# Altium schematic sheet Smartcar.SchDoc
size A2
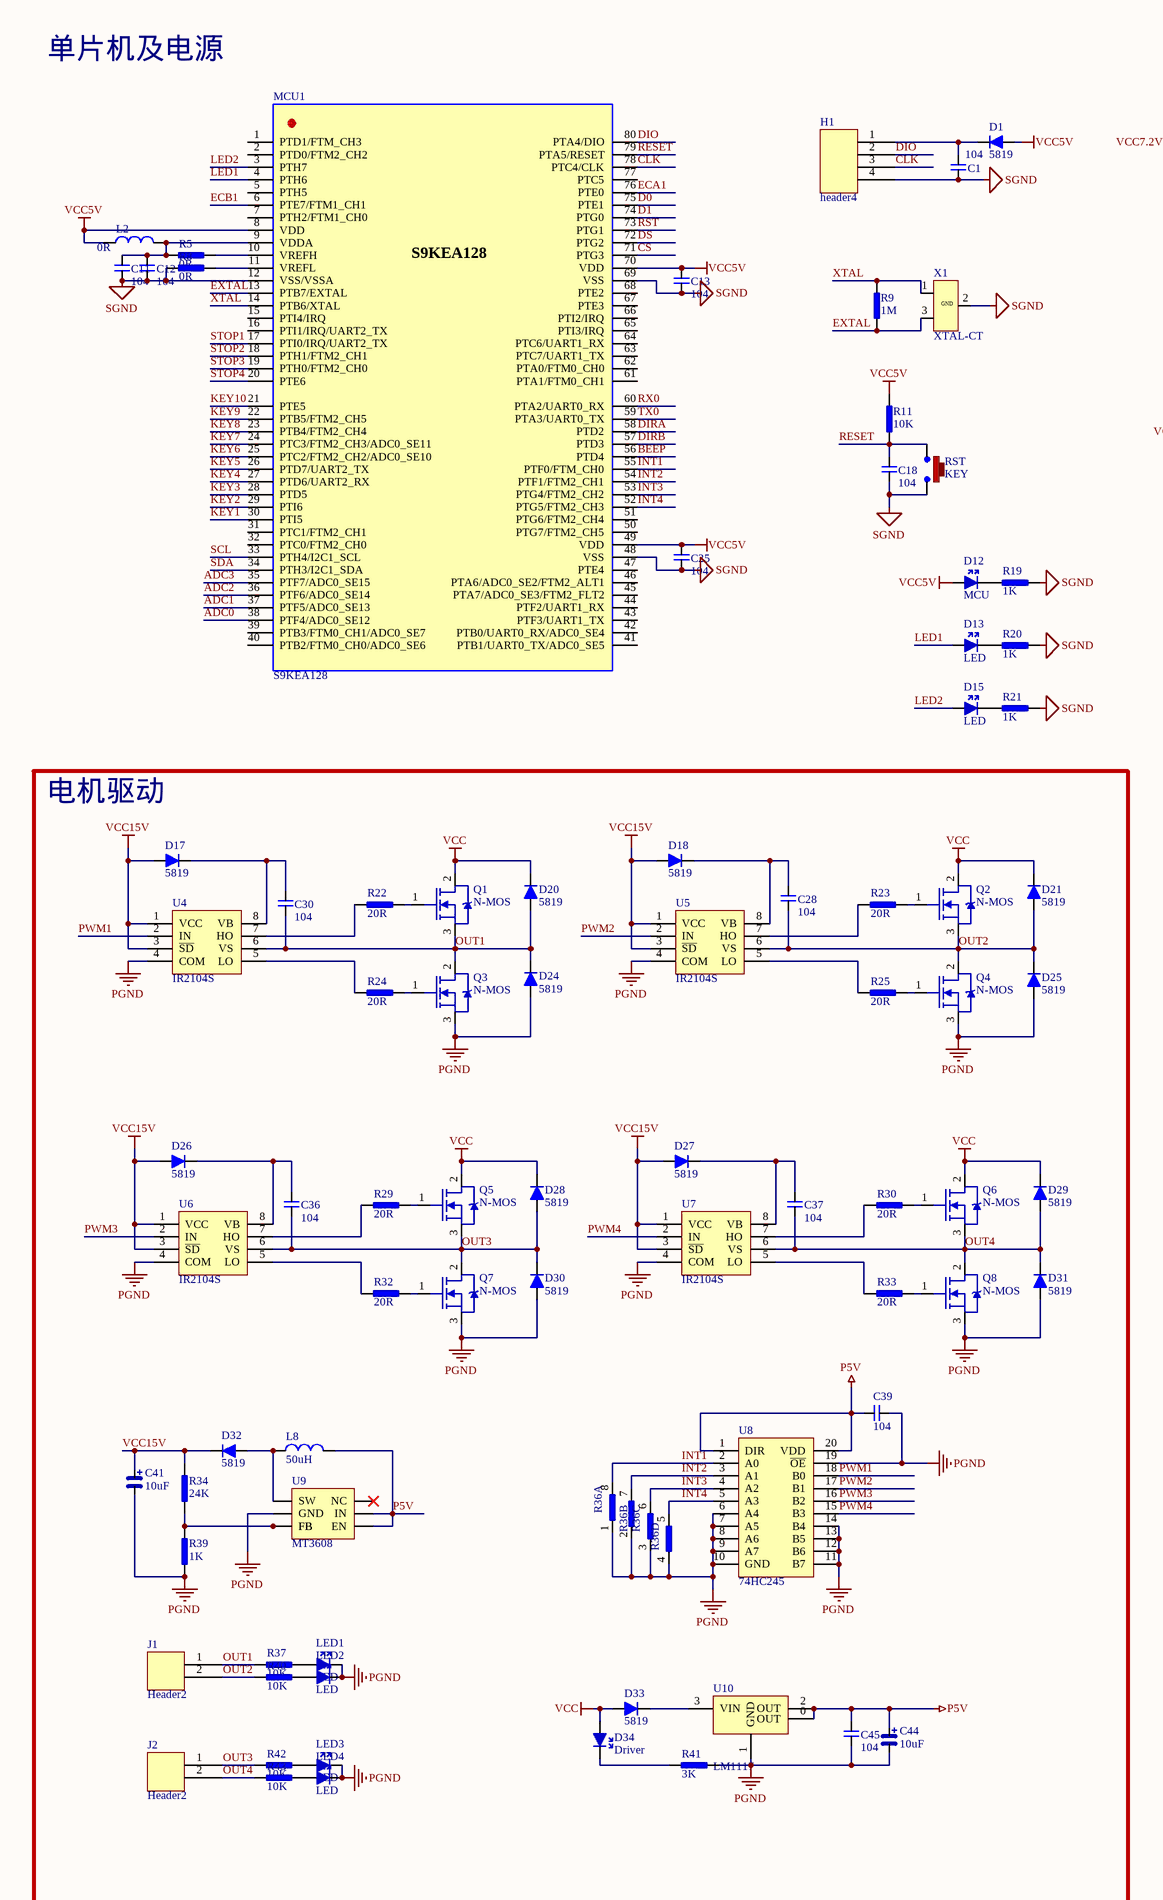
[diagram p0: Smartcar.SchDoc, left]
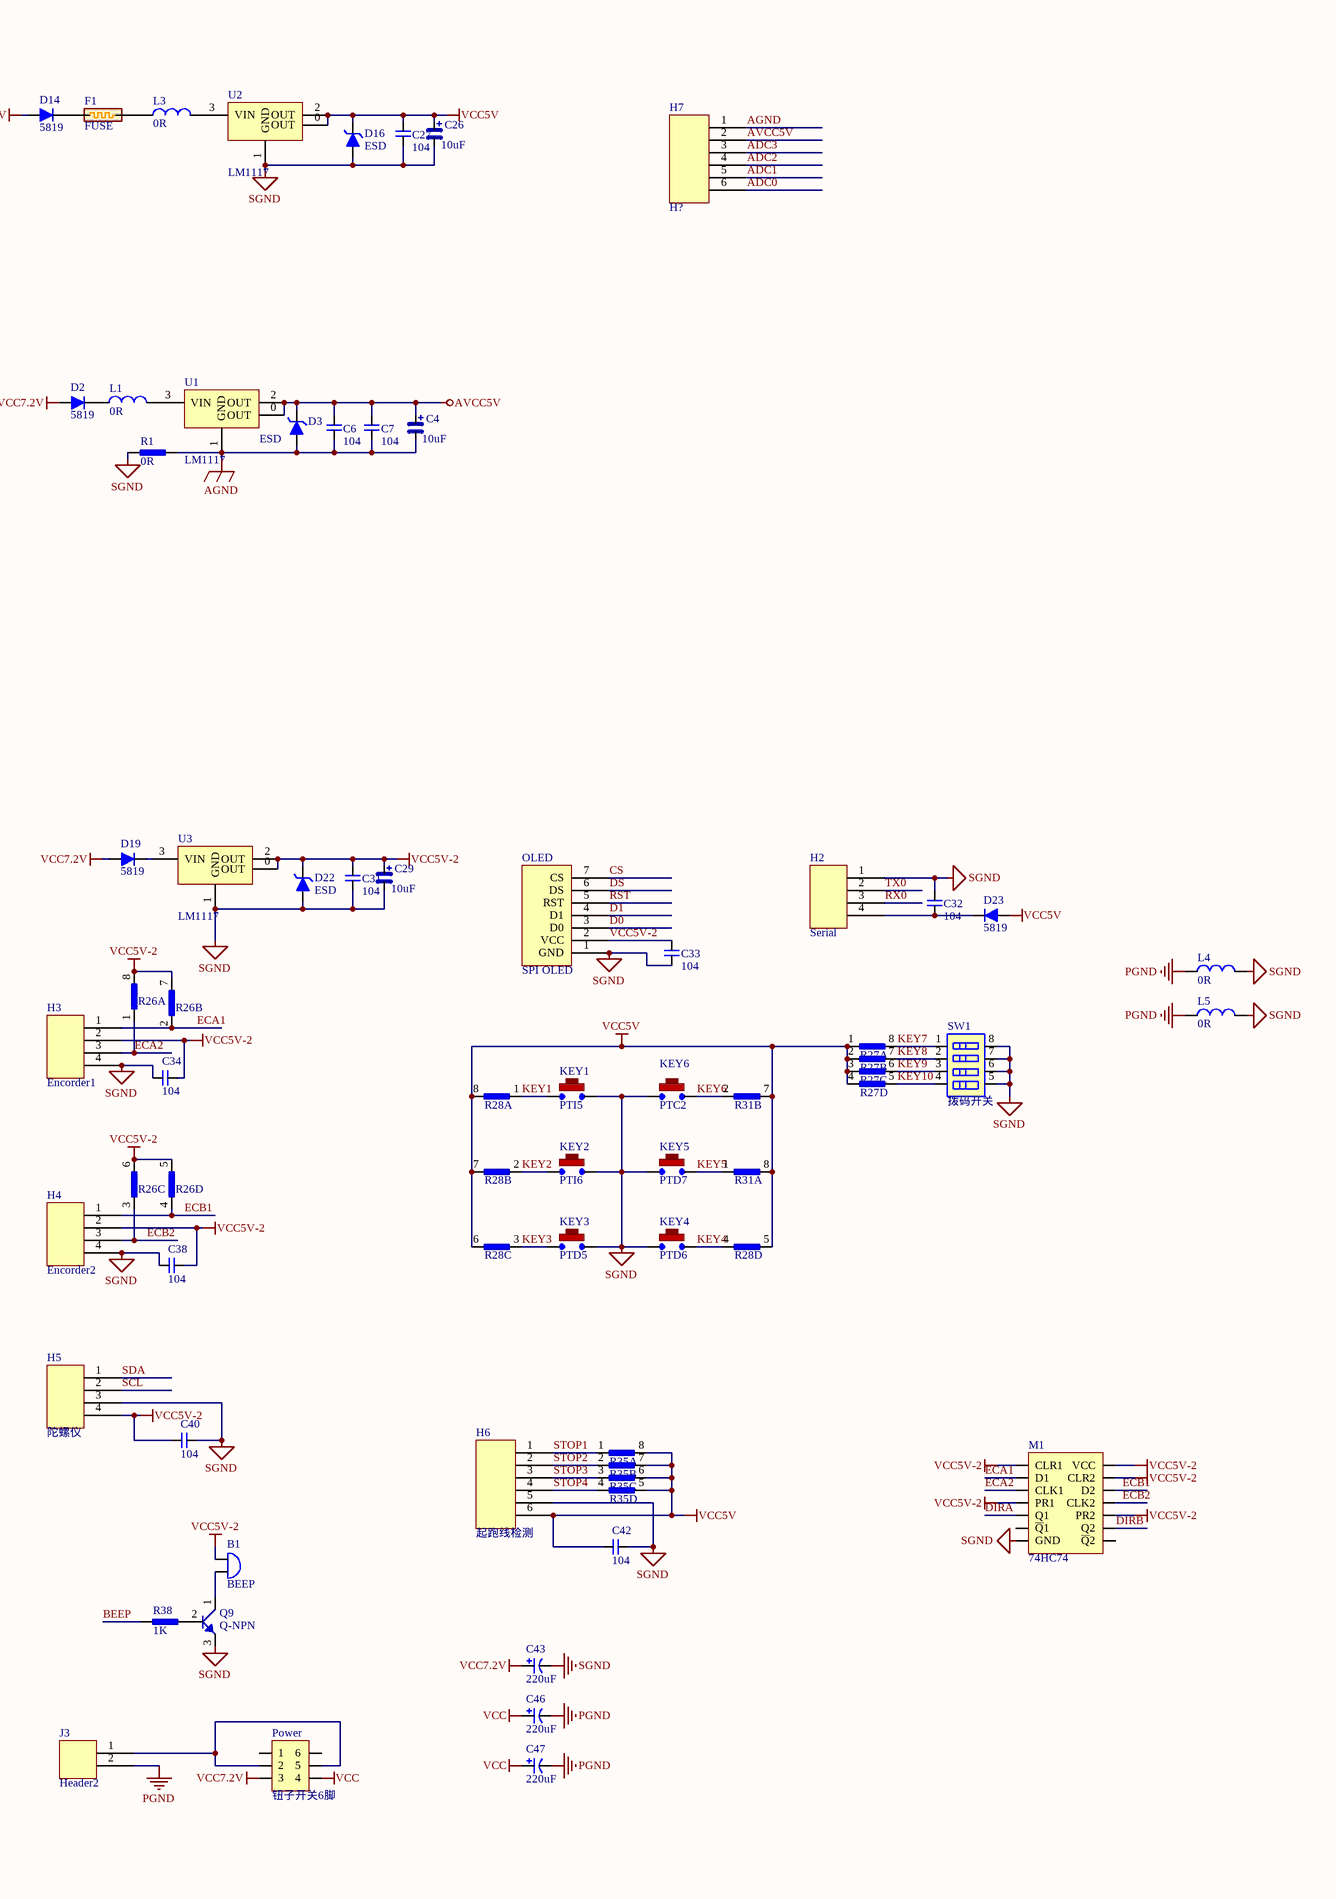
[diagram p1: Smartcar.SchDoc, right]

## Parts
B1  BEEP  [BEEP]
C1  104  [C0603]
C4  10uF  [TAN 3215]
C6  104  [C0603]
C7  104  [C0603]
C11  104  [C0603]
C12  104  [C0603]
C13  104  [C0603]
C18  104  [C0603]
C25  104  [C0603]
C26  10uF  [TAN 3215]
C27  104  [C0603]
C28  104  [C0603]
C29  10uF  [TAN 3215]
C30  104  [C0603]
C31  104  [C0603]
C32  104  [C0603]
C33  104  [C0603]
C34  104  [C0603]
C36  104  [C0603]
C37  104  [C0603]
C38  104  [C0603]
C39  104  [C0603]
C40  104  [C0603]
C41  10uF  [TAN 3215]
C42  104  [C0603]
C43  220uF  [CAP6.6X6.6]
C44  10uF  [TAN 3215]
C45  104  [C0603]
C46  220uF  [CAP6.6X6.6]
C47  220uF  [CAP6.6X6.6]
D1  5819  [SOD323]
D2  5819  [SOD323]
D3  ESD  [SOD323]
D12  MCU  [0603LED]
D13  LED  [0603LED]
D14  5819  [SOD123]
D15  LED  [0603LED]
D16  ESD  [SOD323]
D17  5819  [SOD123]
D18  5819  [SOD123]
D19  5819  [SOD323]
D20  5819  [SOD323]
D21  5819  [SOD323]
D22  ESD  [SOD323]
D23  5819  [SOD323]
D24  5819  [SOD323]
D25  5819  [SOD323]
D26  5819  [SOD123]
D27  5819  [SOD123]
D28  5819  [SOD323]
D29  5819  [SOD323]
D30  5819  [SOD323]
D31  5819  [SOD323]
D32  5819  [SOD123]
D33  5819  [SOD123]
D34  Driver  [0603LED]
F1  FUSE  [R 0805]
H1  header4  [HDR1X4]
H2  Serial  [HDR1X4]
H3  Encorder1  [1.25mm卧贴-4P]
H4  Encorder2  [1.25mm卧贴-4P]
H5  陀螺仪  [1.25mm卧贴-4P]
H6  起跑线检测  [1.25mm卧贴-6P]
H7  H?  [1.25mm卧贴-6P]
J1  Header2  [motor]
J2  Header2  [MOTOR-R]
J3  Header2  [POWER-IN]
KEY1  PTI5  [轻触开关贴片]
KEY2  PTI6  [轻触开关贴片]
KEY3  PTD5  [轻触开关贴片]
KEY4  PTD6  [轻触开关贴片]
KEY5  PTD7  [轻触开关贴片]
KEY6  PTC2  [轻触开关贴片]
L1  0R  [L0603]
L2  0R  [L0603]
L3  0R  [L0603]
L4  0R  [L0603]
L5  0R  [L0603]
L8  50uH  [L-06030]
LED1  LED  [0603LED]
LED2  LED  [0603LED]
LED3  LED  [0603LED]
LED4  LED  [0603LED]
M1  74HC74  [ssoic14]
MCU1  S9KEA128  [LQFP80]
OLED  SPI OLED  [OLED12864]
Power  钮子开关6脚  [钮子开关6脚]
Q1  N-MOS  [TO-252]
Q2  N-MOS  [TO-252]
Q3  N-MOS  [TO-252]
Q4  N-MOS  [TO-252]
Q5  N-MOS  [TO-252]
Q6  N-MOS  [TO-252]
Q7  N-MOS  [TO-252]
Q8  N-MOS  [TO-252]
Q9  Q-NPN  [SOT-23]
R1  0R  [R0603]
R5  0R  [R0603]
R8  0R  [R0603]
R9  1M  [R0603]
R11  10K  [R0603]
R19  1K  [R0603]
R20  1K  [R0603]
R21  1K  [R0603]
R22  20R  [R0603]
R23  20R  [R0603]
R24  20R  [R0603]
R25  20R  [R0603]
R26  Res Pack-4R  [8P4R-0603]  (value not drawn)  (parts A,B,C,D of 4)
R27  Res Pack-4R  [8P4R-0603]  (value not drawn)  (parts A,B,C,D of 4)
R28  Res Pack-4R  [8P4R-0603]  (value not drawn)  (parts A,B,C,D of 4)
R29  20R  [R0603]
R30  20R  [R0603]
R31  Res Pack-4R  [8P4R-0603]  (value not drawn)  (parts A,B of 4)
R32  20R  [R0603]
R33  20R  [R0603]
R34  24K  [R0603]
R35  10K  [8P4R-0603]  (value not drawn)  (parts A,B,C,D of 4)
R36  Res Pack-4R  [8P4R-0603]  (value not drawn)  (parts A,B,C,D of 4)
R37  10K  [R0603]
R38  1K  [R0603]
R39  1K  [R0603]
R40  10K  [R0603]
R41  3K  [R0603]
R42  10K  [R0603]
R43  10K  [R0603]
RST  KEY  [轻触开关贴片]
SW1  拨码开关  [SW-DIP-4 - duplicate]
U1  LM1117  [SOT223]
U2  LM1117  [SOT223]
U3  LM1117  [SOT223]
U4  IR2104S  [SOP-8]
U5  IR2104S  [SOP-8]
U6  IR2104S  [SOP-8]
U7  IR2104S  [SOP-8]
U8  74HC245  [TSSOP-20]
U9  MT3608  [SOT23-6]
U10  LM1117  [SOT223]
X1  XTAL-CT  [CSTCE8M]

## Blocks framed on the sheet
电机驱动: C28 C30 C36 C37 C39 C41 C44 C45 D17 D18 D20 D21 D24-D34 J1 J2 L8 LED1-LED4 Q1-Q8 R22-R25 R29 R30 R32-R34 R36 R37 R39-R43 U4-U10

## Nets
AGND: C4.2 C6.1 C7.1 D3.1 H7.1 R1.2 U1.1(GND)
AVCC5V: C4.1 C6.2 C7.2 D3.2 H7.2 U1.0(OUT) U1.2(OUT)
P5V: C39.1 C44.1 C45.2 L8.1 U8.1(DIR) U8.20(VDD) U9.4(EN) U9.5(IN) U10.0(OUT) U10.2(OUT)
PGND: C39.2 C41.2 C44.2 C45.1 C46.1 C47.1 D24.1 D25.1 D30.1 D31.1 J3.2 L4.2 L5.2 LED1.2 LED2.2 LED3.2 LED4.2 Q3.3 Q4.3 Q7.3 Q8.3 R36.1 R36.2 R36.3 R36.4 R39.1 R41.2 U4.4(COM) U5.4(COM) U6.4(COM) U7.4(COM) U8.6(A4) U8.7(A5) U8.8(A6) U8.9(A7) U8.10(GND) U8.11(B7) U8.12(B6) U8.13(B5) U8.14(B4) U8.19(~{OE}) U9.2(GND) U10.1(GND)
SGND: C1.1 C11.1 C12.1 C13.1 C18.2 C25.1 C26.2 C27.1 C29.2 C31.1 C32.1 C33.1 C34.1 C38.1 C40.2 C42.2 C43.1 D16.1 D22.1 H1.4 H2.1 H3.4 H4.4 H5.3 H6.5 KEY1.2 KEY2.2 KEY3.2 KEY4.1 KEY5.1 KEY6.1 L4.1 L5.1 M1.7(GND) MCU1.12(VSS/VSSA) MCU1.48(VSS) MCU1.69(VSS) OLED.1(GND) Q9.3 R1.1 R8.1 R19.2 R20.2 R21.2 RST.2 SW1.5 SW1.6 SW1.7 SW1.8 U2.1(GND) U3.1(GND) X1.2(GND)
VCC: C46.2 C47.2 D20.2 D21.2 D28.2 D29.2 D33.1 D34.1 Power.4 Q1.2 Q2.2 Q5.2 Q6.2
VCC5V: C13.2 C25.2 C26.1 C27.2 C42.1 D1.1 D12.1 D16.2 D23.1 H6.6 L2.2 MCU1.8(VDD) MCU1.49(VDD) MCU1.70(VDD) R11.1 R27.1 R27.2 R27.3 R27.4 R28.5 R28.6 R28.7 R28.8 R31.7 R31.8 R35.5 R35.6 R35.7 R35.8 U2.0(OUT) U2.2(OUT)
VCC5V-2: B1.1 C29.1 C31.2 C33.2 C34.2 C38.2 C40.1 D22.2 H3.2 H4.2 H5.4 M1.1(CLR1) M1.4(PR1) M1.10(PR2) M1.13(CLR2) M1.14(VCC) OLED.2(VCC) R26.5 R26.6 R26.7 R26.8 U3.0(OUT) U3.2(OUT)
VCC7.2V: C43.2 D2.1 D14.1 D19.1 Power.3
VCC15V: C41.1 D17.1 D18.1 D26.1 D27.1 D32.2 R34.2 U4.1(VCC) U4.3(~{SD}) U5.1(VCC) U5.3(~{SD}) U6.1(VCC) U6.3(~{SD}) U7.1(VCC) U7.3(~{SD})
ADC0: H7.6 MCU1.38(PTF4/ADC0_SE12)
ADC1: H7.5 MCU1.37(PTF5/ADC0_SE13)
ADC2: H7.4 MCU1.36(PTF6/ADC0_SE14)
ADC3: H7.3 MCU1.35(PTF7/ADC0_SE15)
BEEP: MCU1.56(PTD4) R38.1
CLK: H1.3 MCU1.78(PTC4/CLK)
CS: MCU1.71(PTG3) OLED.7(CS)
D0: MCU1.75(PTE1) OLED.3(D0)
D1: MCU1.74(PTG0) OLED.4(D1)
DIO: H1.2 MCU1.80(PTA4/DIO)
DIRA: M1.5(Q1) MCU1.58(PTD2)
DIRB: M1.9(Q2) MCU1.57(PTD3)
DS: MCU1.72(PTG2) OLED.6(DS)
ECA1: H3.1 M1.2(D1) MCU1.76(PTE0) R26.2
ECA2: H3.3 M1.3(CLK1) R26.1
ECB1: H4.1 M1.12(D2) MCU1.6(PTE7/FTM1_CH1) R26.4
ECB2: H4.3 M1.11(CLK2) R26.3
EXTAL: MCU1.13(PTB7/EXTAL) R9.1 X1.3
INT1: MCU1.55(PTF0/FTM_CH0) R36.8 U8.2(A0)
INT2: MCU1.54(PTF1/FTM2_CH1) R36.7 U8.3(A1)
INT3: MCU1.53(PTG4/FTM2_CH2) R36.6 U8.4(A2)
INT4: MCU1.52(PTG5/FTM2_CH3) R36.5 U8.5(A3)
KEY1: KEY1.1 MCU1.30(PTI5) R28.1
KEY2: KEY2.1 MCU1.29(PTI6) R28.2
KEY3: KEY3.1 MCU1.28(PTD5) R28.3
KEY4: KEY4.2 MCU1.27(PTD6/UART2_RX) R28.4
KEY5: KEY5.2 MCU1.26(PTD7/UART2_TX) R31.1
KEY6: KEY6.2 MCU1.25(PTC2/FTM2_CH2/ADC0_SE10) R31.2
KEY7: MCU1.24(PTC3/FTM2_CH3/ADC0_SE11) R27.8 SW1.1
KEY8: MCU1.23(PTB4/FTM2_CH4) R27.7 SW1.2
KEY9: MCU1.22(PTB5/FTM2_CH5) R27.6 SW1.3
KEY10: MCU1.21(PTE5) R27.5 SW1.4
LED1: D13.1 MCU1.4(PTH6)
LED2: D15.1 MCU1.3(PTH7)
OUT1: C30.2 D20.1 D24.2 J1.1 Q1.3 Q3.2 R37.1 U4.6(VS)
OUT2: C28.2 D21.1 D25.2 J1.2 Q2.3 Q4.2 R40.1 U5.6(VS)
OUT3: C36.2 D28.1 D30.2 J2.1 Q5.3 Q7.2 R42.1 U6.6(VS)
OUT4: C37.2 D29.1 D31.2 J2.2 Q6.3 Q8.2 R43.1 U7.6(VS)
PWM1: U4.2(IN) U8.18(B0)
PWM2: U5.2(IN) U8.17(B1)
PWM3: U6.2(IN) U8.16(B2)
PWM4: U7.2(IN) U8.15(B3)
RESET: C18.1 MCU1.79(PTA5/RESET) R11.2 RST.1
RST: MCU1.73(PTG1) OLED.5(RST)
RX0: H2.3 MCU1.60(PTA2/UART0_RX)
SCL: H5.2 MCU1.33(PTH4/I2C1_SCL)
SDA: H5.1 MCU1.34(PTH3/I2C1_SDA)
STOP1: H6.1 MCU1.17(PTI0/IRQ/UART2_TX) R35.1
STOP2: H6.2 MCU1.18(PTH1/FTM2_CH1) R35.2
STOP3: H6.3 MCU1.19(PTH0/FTM2_CH0) R35.3
STOP4: H6.4 MCU1.20(PTE6) R35.4
TX0: H2.2 MCU1.59(PTA3/UART0_TX)
XTAL: MCU1.14(PTB6/XTAL) R9.2 X1.1
NetB1_2: B1.2 Q9.1
NetC1_2: C1.2 D1.2 H1.1
NetC11_2: C11.2 C12.2 L2.1 MCU1.9(VDDA) R5.1
NetC28_1: C28.1 D18.2 U5.8(VB)
NetC30_1: C30.1 D17.2 U4.8(VB)
NetC32_2: C32.2 D23.2 H2.4
NetC36_1: C36.1 D26.2 U6.8(VB)
NetC37_1: C37.1 D27.2 U7.8(VB)
NetD2_2: D2.2 L1.2
NetD12_2: D12.2 R19.1
NetD13_2: D13.2 R20.1
NetD14_2: D14.2 F1.1
NetD15_2: D15.2 R21.1
NetD19_2: D19.2 U3.3(VIN)
NetD32_1: D32.1 L8.2 U9.1(SW)
NetD33_2: D33.2 U10.3(VIN)
NetD34_2: D34.2 R41.1
NetF1_2: F1.2 L3.2
NetJ3_1: J3.1 Power.2 Power.5
NetL1_1: L1.1 U1.3(VIN)
NetL3_1: L3.1 U2.3(VIN)
NetLED1_1: LED1.1 R37.2
NetLED2_1: LED2.1 R40.2
NetLED3_1: LED3.1 R42.2
NetLED4_1: LED4.1 R43.2
NetMCU1_10: MCU1.10(VREFH) R5.2
NetMCU1_11: MCU1.11(VREFL) R8.2
NetQ1_1: Q1.1 R22.2
NetQ2_1: Q2.1 R23.2
NetQ3_1: Q3.1 R24.2
NetQ4_1: Q4.1 R25.2
NetQ5_1: Q5.1 R29.2
NetQ6_1: Q6.1 R30.2
NetQ7_1: Q7.1 R32.2
NetQ8_1: Q8.1 R33.2
NetQ9_2: Q9.2 R38.2
NetR22_1: R22.1 U4.7(HO)
NetR23_1: R23.1 U5.7(HO)
NetR24_1: R24.1 U4.5(LO)
NetR25_1: R25.1 U5.5(LO)
NetR29_1: R29.1 U6.7(HO)
NetR30_1: R30.1 U7.7(HO)
NetR32_1: R32.1 U6.5(LO)
NetR33_1: R33.1 U7.5(LO)
NetR34_1: R34.1 R39.2 U9.3(FB)

Not connected (* = marked no-connect by the designer): M1 6(~{Q}1) 8(~{Q}2); MCU1 1(PTD1/FTM_CH3) 2(PTD0/FTM2_CH2) 5(PTH5) 7(PTH2/FTM1_CH0) 15(PTI4/IRQ) 16(PTI1/IRQ/UART2_TX) 31(PTC1/FTM2_CH1) 32(PTC0/FTM2_CH0) 39(PTB3/FTM0_CH1/ADC0_SE7) 40(PTB2/FTM0_CH0/ADC0_SE6) 41(PTB1/UART0_TX/ADC0_SE5) 42(PTB0/UART0_RX/ADC0_SE4) 43(PTF3/UART1_TX) 44(PTF2/UART1_RX) 45(PTA7/ADC0_SE3/FTM2_FLT2) 46(PTA6/ADC0_SE2/FTM2_ALT1) 47(PTE4) 50(PTG7/FTM2_CH5) 51(PTG6/FTM2_CH4) 61(PTA1/FTM0_CH1) 62(PTA0/FTM0_CH0) 63(PTC7/UART1_TX) 64(PTC6/UART1_RX) 65(PTI3/IRQ) 66(PTI2/IRQ) 67(PTE3) 68(PTE2) 77(PTC5); Power 1 6; U9 6(NC)*

## Notes on the sheet
- 单片机及电源

## Library data of the parts
C1 C6 C7 C11-C13 C18 C25 C27 C28 C30-C34 C36-C40 C42 C45 = CAP
C4 C26 C29 C41 C44 = C-TAN
C43 C46 C47 = CAP-SMD
D1 D2 D14 D19 D33 = diode
D3 D16 D22 = D-ESD
D12 D34 = LED
D17 D18 D20 D21 D23-D32 = Diode
H2-H5 = header4
H6 H7 = header6
KEY1-KEY6 = KEY
L1-L5 L8 = Inductance
R1 R5 R8 R9 R11 R19-R25 R29 R30 R32-R34 R37-R43 = RES
R26-R28 R31 R35 R36 = Res Pack-4R: 排阻; Sim Note: Enter the Resistance value into parameter field.; Value: 20R; Published: 24-Mar-1999; LatestRevisionDate: 29-May-2009; LatestRevisionNote: IPC-7351 Footprint Added.; PackageReference: SOIC16; Publisher: Altium Limited; PackageDescription: 16-Pin Small Outline Integrated Circuit 1.27 mm Pitch; Code_JEDEC: MS-012-AC; Code_IPC: SOIC127P600-16
U1-U3 U10 = 1117
U4-U7 = IR2104S: 半桥驱动器